# Altium schematic sheet dmpro16-pcb-v1-FPGA-Power.SchDoc
size A4; DocumentNumber: 10; SheetNumber: 10; SheetTotal: 17; SheetName: FPGA-Power
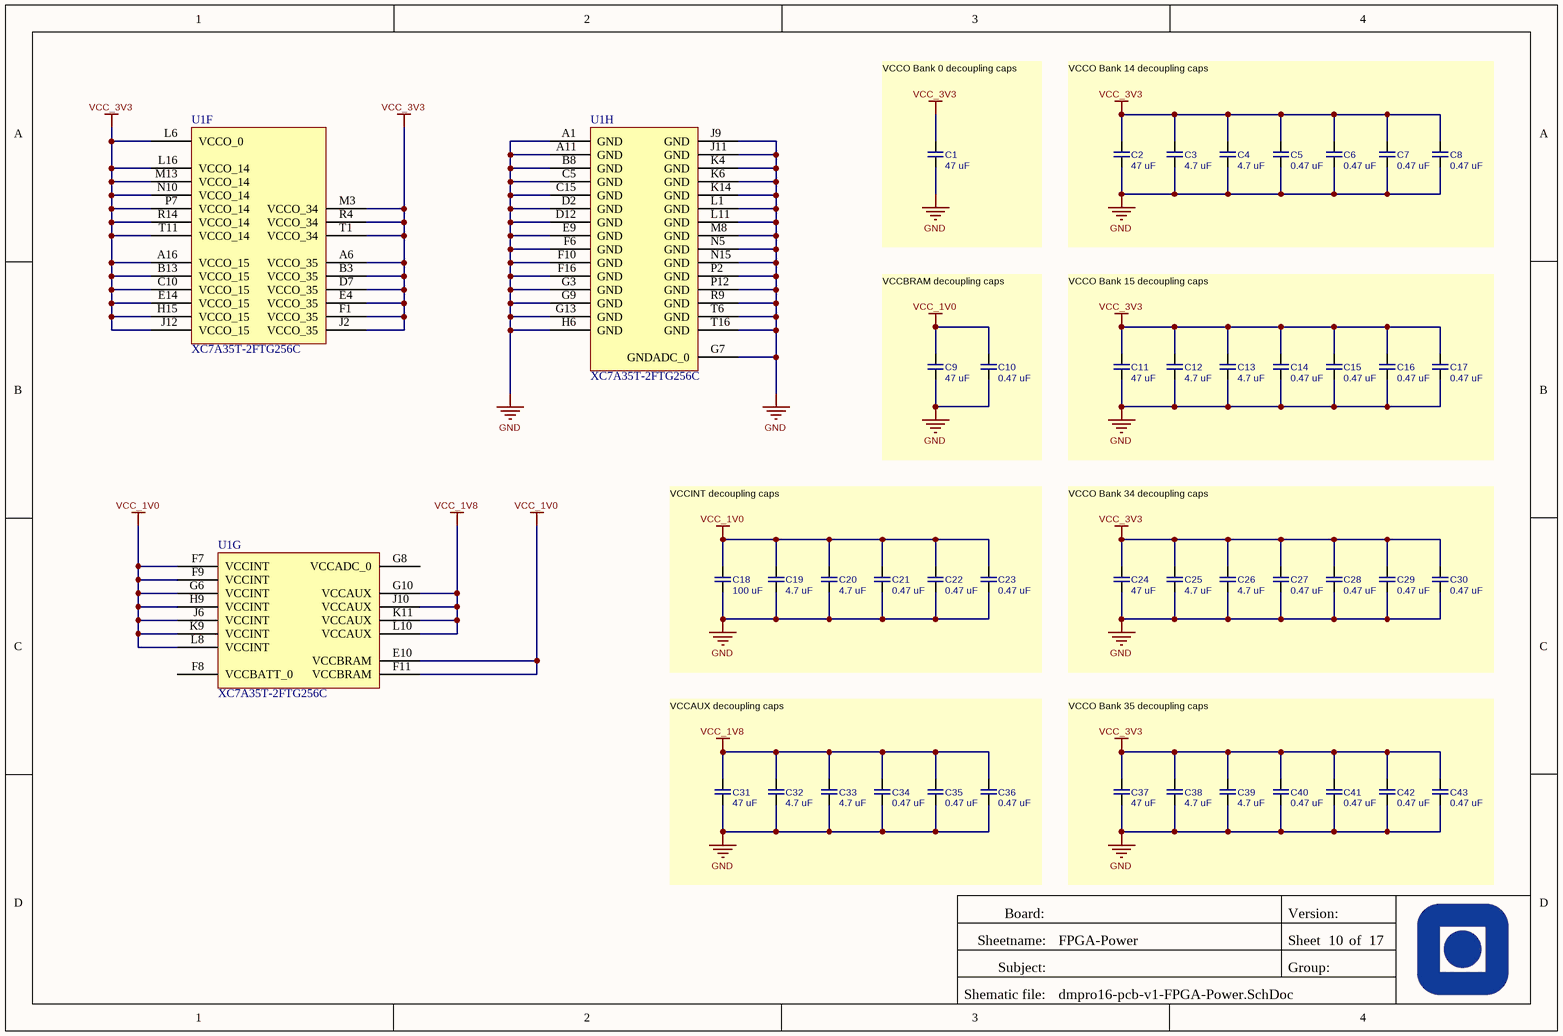
[diagram p0: dmpro16-pcb-v1-FPGA-Power.SchDoc]

## Parts
C1  47 uF  [CAPC2012_0h50]
C2  47 uF  [CAPC2012_0h50]
C3  4.7 uF  [CAPC2012_0h50]
C4  4.7 uF  [CAPC2012_0h50]
C5  0.47 uF  [CAPC2012_0h50]
C6  0.47 uF  [CAPC2012_0h50]
C7  0.47 uF  [CAPC2012_0h50]
C8  0.47 uF  [CAPC2012_0h50]
C9  47 uF  [CAPC2012_0h50]
C10  0.47 uF  [CAPC2012_0h50]
C11  47 uF  [CAPC2012_0h50]
C12  4.7 uF  [CAPC2012_0h50]
C13  4.7 uF  [CAPC2012_0h50]
C14  0.47 uF  [CAPC2012_0h50]
C15  0.47 uF  [CAPC2012_0h50]
C16  0.47 uF  [CAPC2012_0h50]
C17  0.47 uF  [CAPC2012_0h50]
C18  100 uF  [CAPC2012_0h50]
C19  4.7 uF  [CAPC2012_0h50]
C20  4.7 uF  [CAPC2012_0h50]
C21  0.47 uF  [CAPC2012_0h50]
C22  0.47 uF  [CAPC2012_0h50]
C23  0.47 uF  [CAPC2012_0h50]
C24  47 uF  [CAPC2012_0h50]
C25  4.7 uF  [CAPC2012_0h50]
C26  4.7 uF  [CAPC2012_0h50]
C27  0.47 uF  [CAPC2012_0h50]
C28  0.47 uF  [CAPC2012_0h50]
C29  0.47 uF  [CAPC2012_0h50]
C30  0.47 uF  [CAPC2012_0h50]
C31  47 uF  [CAPC2012_0h50]
C32  4.7 uF  [CAPC2012_0h50]
C33  4.7 uF  [CAPC2012_0h50]
C34  0.47 uF  [CAPC2012_0h50]
C35  0.47 uF  [CAPC2012_0h50]
C36  0.47 uF  [CAPC2012_0h50]
C37  47 uF  [CAPC2012_0h50]
C38  4.7 uF  [CAPC2012_0h50]
C39  4.7 uF  [CAPC2012_0h50]
C40  0.47 uF  [CAPC2012_0h50]
C41  0.47 uF  [CAPC2012_0h50]
C42  0.47 uF  [CAPC2012_0h50]
C43  0.47 uF  [CAPC2012_0h50]
U1  XC7A35T-2FTG256C  [FTG256]  (parts F,G,H of 8)

## Nets
GND: C1.1 C2.1 C3.1 C4.1 C5.1 C6.1 C7.1 C8.1 C9.1 C10.1 C11.1 C12.1 C13.1 C14.1 C15.1 C16.1 C17.1 C18.1 C19.1 C20.1 C21.1 C22.1 C23.1 C24.1 C25.1 C26.1 C27.1 C28.1 C29.1 C30.1 C31.1 C32.1 C33.1 C34.1 C35.1 C36.1 C37.1 C38.1 C39.1 C40.1 C41.1 C42.1 C43.1 U1.A1(GND) U1.A11(GND) U1.B8(GND) U1.C5(GND) U1.C15(GND) U1.D2(GND) U1.D12(GND) U1.E9(GND) U1.F6(GND) U1.F10(GND) U1.F16(GND) U1.G3(GND) U1.G7(GNDADC_0) U1.G9(GND) U1.G13(GND) U1.H6(GND) U1.J9(GND) U1.J11(GND) U1.K4(GND) U1.K6(GND) U1.K14(GND) U1.L1(GND) U1.L11(GND) U1.M8(GND) U1.N5(GND) U1.N15(GND) U1.P2(GND) U1.P12(GND) U1.R9(GND) U1.T6(GND) U1.T16(GND)
VCC_1V0: C9.2 C10.2 C18.2 C19.2 C20.2 C21.2 C22.2 C23.2 U1.E10(VCCBRAM) U1.F7(VCCINT) U1.F9(VCCINT) U1.F11(VCCBRAM) U1.G6(VCCINT) U1.H9(VCCINT) U1.J6(VCCINT) U1.K9(VCCINT) U1.L8(VCCINT)
VCC_1V8: C31.2 C32.2 C33.2 C34.2 C35.2 C36.2 U1.G10(VCCAUX) U1.J10(VCCAUX) U1.K11(VCCAUX) U1.L10(VCCAUX)
VCC_3V3: C1.2 C2.2 C3.2 C4.2 C5.2 C6.2 C7.2 C8.2 C11.2 C12.2 C13.2 C14.2 C15.2 C16.2 C17.2 C24.2 C25.2 C26.2 C27.2 C28.2 C29.2 C30.2 C37.2 C38.2 C39.2 C40.2 C41.2 C42.2 C43.2 U1.A6(VCCO_35) U1.A16(VCCO_15) U1.B3(VCCO_35) U1.B13(VCCO_15) U1.C10(VCCO_15) U1.D7(VCCO_35) U1.E4(VCCO_35) U1.E14(VCCO_15) U1.F1(VCCO_35) U1.H15(VCCO_15) U1.J2(VCCO_35) U1.J12(VCCO_15) U1.L6(VCCO_0) U1.L16(VCCO_14) U1.M3(VCCO_34) U1.M13(VCCO_14) U1.N10(VCCO_14) U1.P7(VCCO_14) U1.R4(VCCO_34) U1.R14(VCCO_14) U1.T1(VCCO_34) U1.T11(VCCO_14)

Not connected (* = marked no-connect by the designer): U1 F8(VCCBATT_0) G8(VCCADC_0)

## Notes on the sheet
- (near C1) VCCO Bank 0 decoupling caps
- VCCO Bank 14 decoupling caps
- VCCBRAM decoupling caps
- VCCO Bank 15 decoupling caps
- VCCINT decoupling caps
- VCCO Bank 34 decoupling caps
- VCCAUX decoupling caps
- VCCO Bank 35 decoupling caps
- Board:
- Version:
- Sheetname:
- Subject:
- Group:
- Sheet
- of
- Shematic file:

## Library data of the parts
C1 C2 C9 C11 C24 C31 C37 = cap_unpol_1608_47uF: 47 uF unpolarized capacitor (1608 size); Suggested Part Number: GRM32ER70J476ME20L; Voltage Rating: 6.3 V; Type: 2-Terminal Ceramic X7R or X5R; ESL Maximum: 1 nH; ESR Range: 1 mOhm - 40 mOhm; Value Range: C > 47 uF; Body Size (metric): 3225; Ideal Value: 47 uF
C3 C4 C12 C13 C19 C20 C25 C26 C32 C33 C38 C39 = cap_unpol_1608_4.7uF: 4.7 uF unpolarized capacitor (1608 size); Suggested Part Number: GRM21BR71A475KA73; Voltage Rating: 6.3 V; ESR Range: 1 mOhm - 20 mOhm; ESL Maximum: 0.5 nH; Type: 2-Terminal Ceramic X7R or X5R; Value Range: C > 4.7 uF; Body Size (metric): 2012; Ideal Value: 4.7 uF
C5-C8 C10 C14-C17 C21-C23 C27-C30 C34-C36 C40-C43 = cap_unpol_1608_0.47uF: 0.47 uF unpolarized capacitor (1608 size); Suggested Part Number: GRM188R70J474KA01; Voltage rating: 6.3 V; ESR Range: 1 mOhm - 20 mOhm; ESL Maximum: 0.5 nH; Type: 2-Terminal Ceramic X7R or X5R; Value Range: C > 0.47 uF; Body Size (metric): 1608; Ideal Value: 0.47 uF
C18 = cap_unpol_1608_100uF: 100 uF unpolarized capacitor (1608 size); Suggested Part Number: GRM32ER60J107ME20L; Voltage Rating: 2.5 V; Type: 2-Terminal Tantalum Ceramic X7R or X5R; ESL Maximum: 1 nH; ESR Range: 1 mOhm - 40 mOhm; Value Range: C > 100 uF; Body Size (metric): 3225; Ideal Value: 100 uF
U1 = XC7A35T-2FTG256C: Artix-7 FPGA, 170 User I/Os, 0 GTP, 256-Ball BGA, Speed Grade 2, Commercial Grade, Pb-Free; Manufacturer: Xilinx; Total Block RAM: 1800 Kb; GTP: 0; Clock Mgmt Tiles (CMTs): 5; Logic Cells: 33280; Available User I/O: 170; Speed Grades: 2; DatasheetVersion: v1.15; PackageVersion: Rev. 1.11; PackageReference: FTG-256; PackageDescription: 256-Ball Wire-Bond Fine-Pitch Thin BGA, Body 17 x 17 mm, Pitch 1 mm; Maximum Distributed RAM: 400 Kb; Operating Temperature Range: Commercial; NexusDeviceID: XC7A35T-2FTG256C; Mounting Technology: Surface Mount; PartNumber: XC7A35T-2FTG256C; ComponentLink1Description: Manufacturer URL; ComponentLink1URL: http://www.xilinx.com/; ComponentLink2Description: Datasheet; ComponentLink2URL: http://www.xilinx.com/support/documentation/data_sheets/ds180_7Series_Overview.pdf; ComponentLink3Description: Package Specification; ComponentLink3URL: http://www.xilinx.com/support/documentation/user_guides/ug475_7Series_Pkg_Pinout.pdf; ComponentLink4Description: DC and Switching Characteristics; ComponentLink4URL: http://www.xilinx.com/support/documentation/data_sheets/ds181_Artix_7_Data_Sheet.pdf; ComponentLink5Description: Package File; ComponentLink5URL: http://www.xilinx.com/support/packagefiles/a7packages/xc7a200tsbg484pkg.txt; ComponentLink6Description: Packaging and Pinout; ComponentLink6URL: http://www.xilinx.com/support/documentation/user_guides/ug475_7Series_Pkg_Pinout.pdf